# EasyEDA Pro project 基于ASM1153E的TYPEC接口的MSATA硬盘盒子.eprj, schematic schematic1_1
Create Date: 2022-09-16; Page Name: P1; Project Name: 基于ASM1153E的TYPEC接口的MSATA硬盘盒子; Schematic Name: Schematic1_1; Update Date: 2022-10-08; Company: 嘉立创EDA
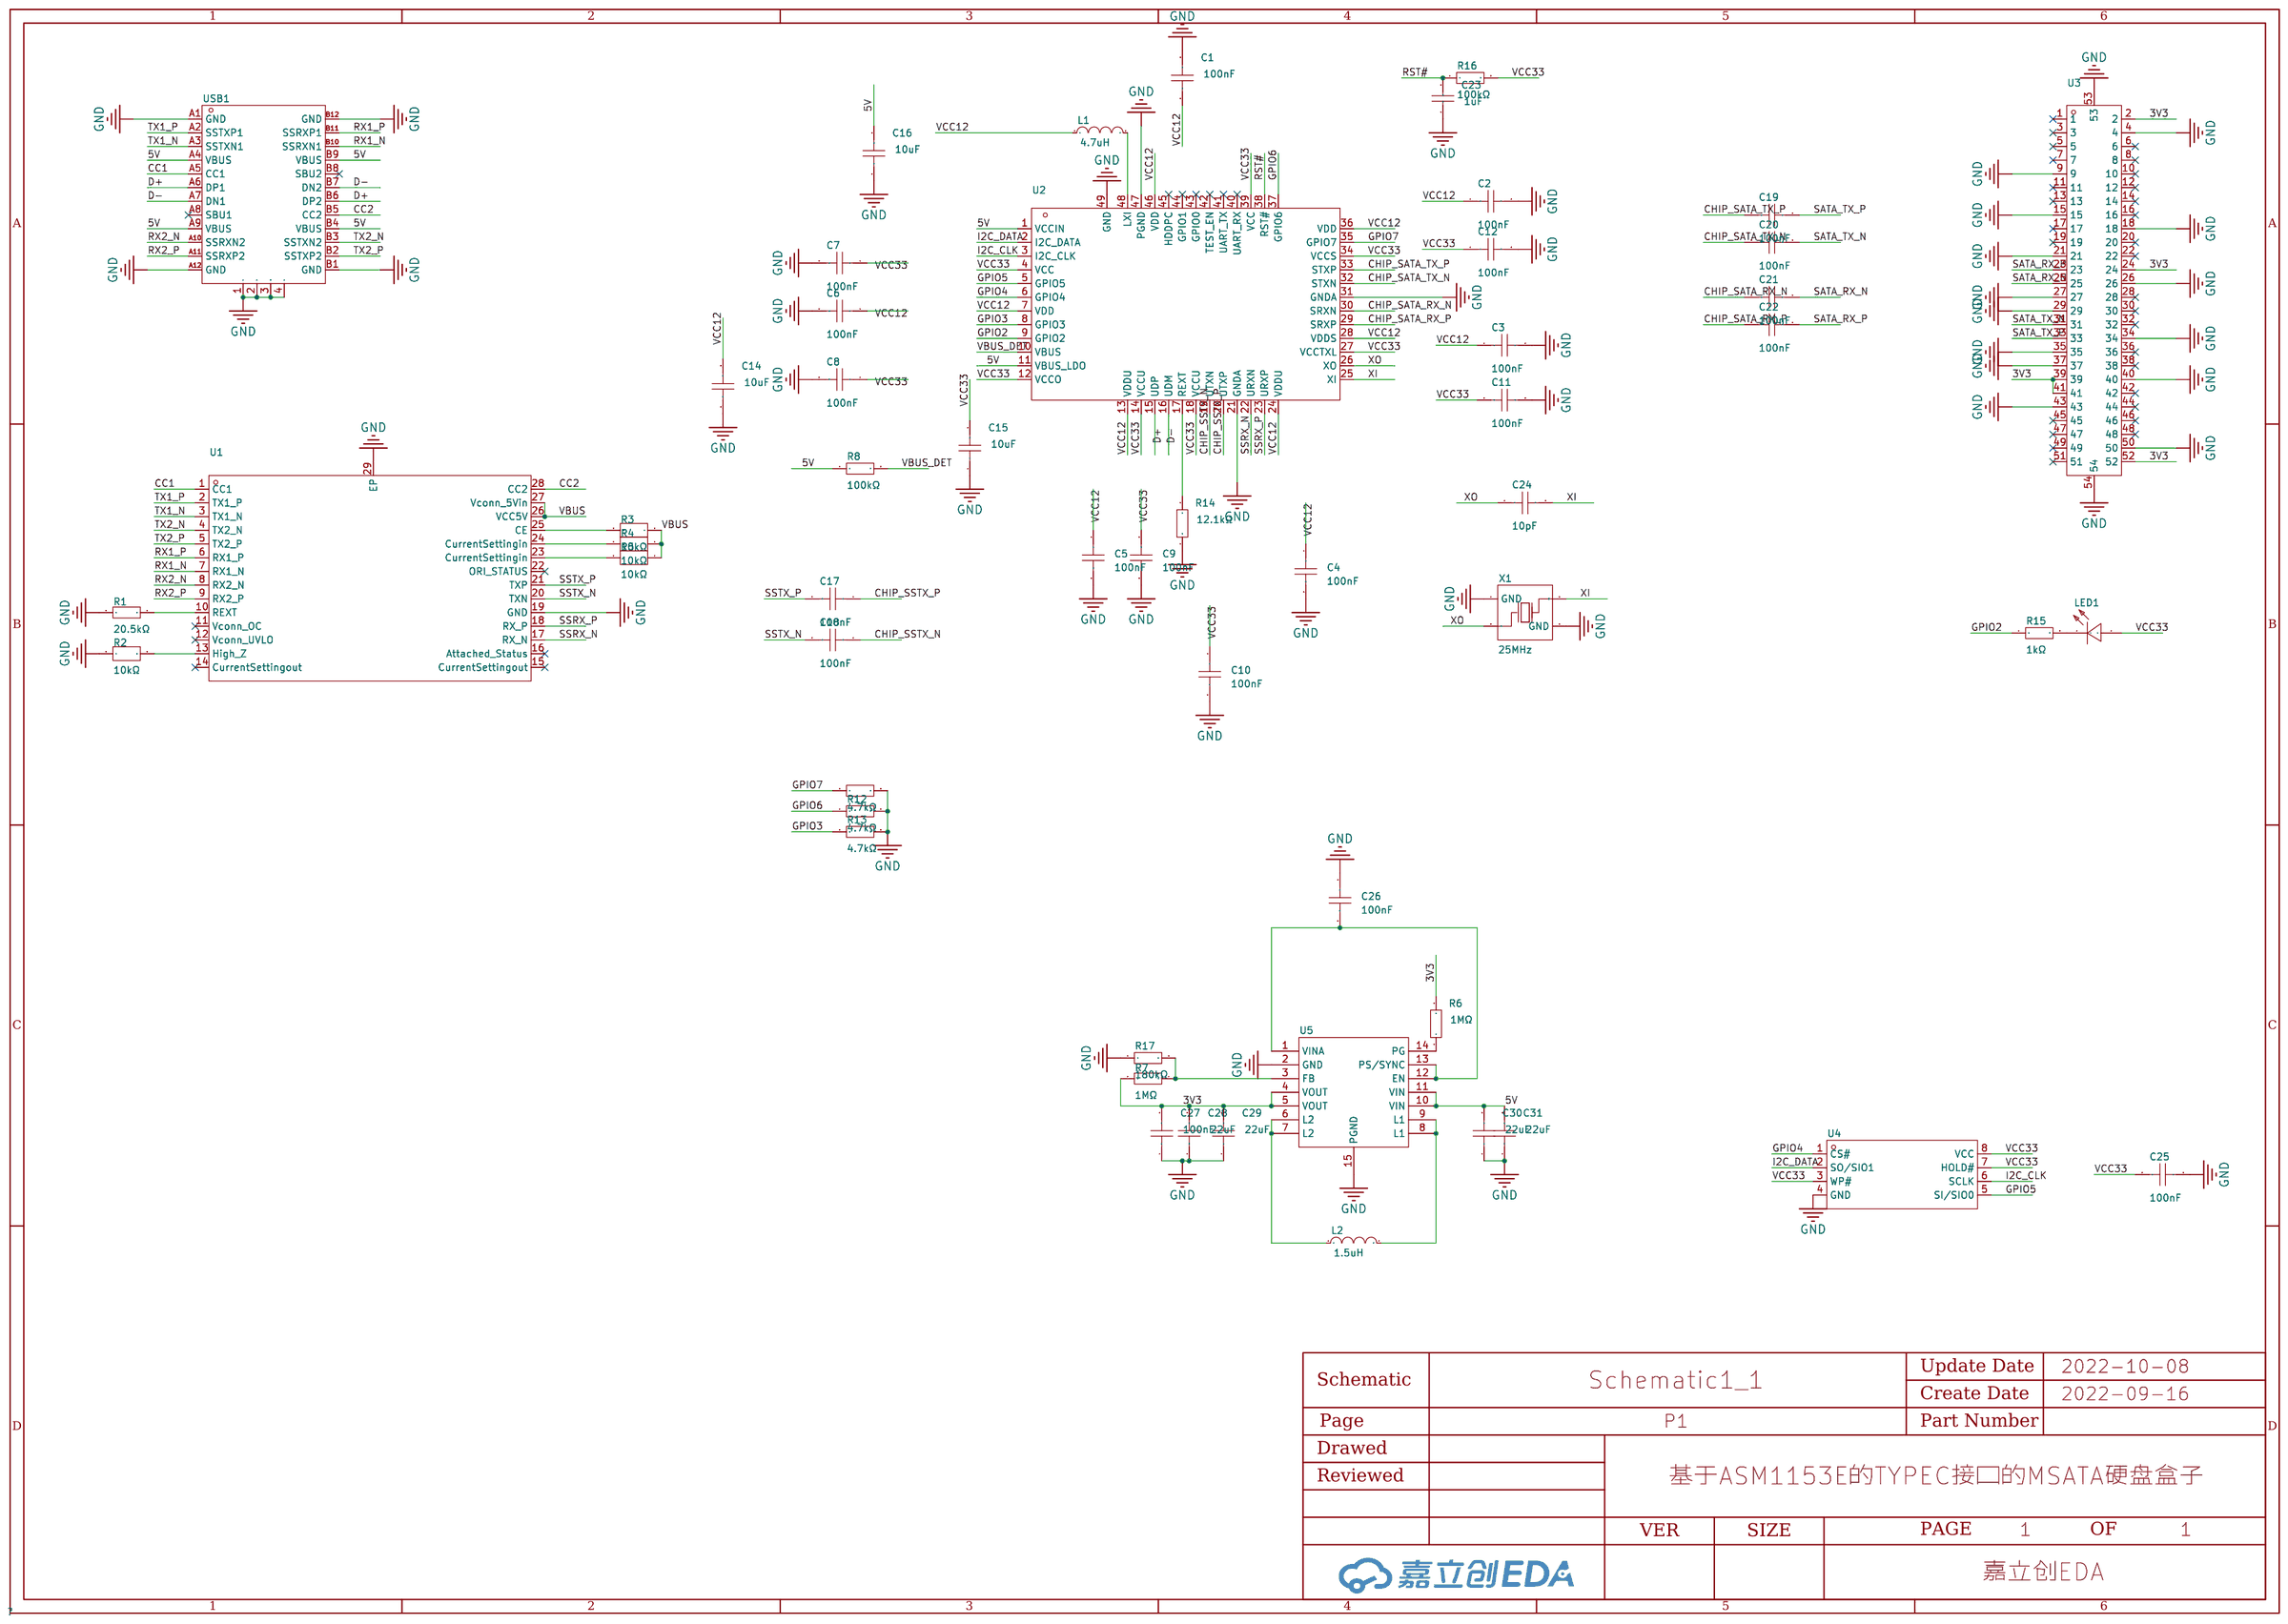
[diagram p1: schematic sheet]

## Parts
C1  100nF  [C0402]
C2  100nF  [C0402]
C3  100nF  [C0402]
C4  100nF  [C0402]
C5  100nF  [C0402]
C6  100nF  [C0402]
C7  100nF  [C0402]
C8  100nF  [C0402]
C9  100nF  [C0402]
C10  100nF  [C0402]
C11  100nF  [C0402]
C12  100nF  [C0402]
C14  10uF  [C0603]
C15  10uF  [C0603]
C16  10uF  [C0603]
C17  100nF  [C0402]
C18  100nF  [C0402]
C19  100nF  [C0402]
C20  100nF  [C0402]
C21  100nF  [C0402]
C22  100nF  [C0402]
C23  1uF  [C0402]
C24  10pF  [C0402]
C25  100nF  [C0402]
C26  100nF  [C0402]
C27  100nF  [C0402]
C28  22uF  [C0603]
C29  22uF  [C0603]
C30  22uF  [C0603]
C31  22uF  [C0603]
L1  4.7uH  [IND-SMD_L3.0-W3.0-1]
L2  1.5uH  [IND-SMD_L4.8-W4.2]
LED1  VLMW1500-GS08  [LED0402-R-RD_WHITE]
R1  20.5kΩ  [R0402]
R2  10kΩ  [R0402]
R3  10kΩ  [R0402]
R4  10kΩ  [R0402]
R5  10kΩ  [R0402]
R6  1MΩ  [R0402]
R7  1MΩ  [R0402]
R8  100kΩ  [R0402]
R11  4.7kΩ  [R0402]
R12  4.7kΩ  [R0402]
R13  4.7kΩ  [R0402]
R14  12.1kΩ  [R0402]
R15  1kΩ  [R0402]
R16  100kΩ  [R0402]
R17  180kΩ  [R0402]
U1  VL160  [MQFN-28_L4.5-W3.5-P0.40-BL-EP]
U2  ASM1153E  [QFN-48_L6.0-W6.0-P0.40-BL-EP4.2]
U3  PCIE-52P70H  [PCIE-SMD_52P-P0.80_PCIE-52PXXH]
U4  MX25L512EMI-10G  [SOP-8_L5.0-W4.0-P1.27-LS6.0-BL]
U5  TPS63020DSJR  [VSON-14_L4.0-W3.0-P0.50-BL-EP_TI_DSJ]
USB1  U262-241N-4BV60  [USB-C-SMD_U262-241N-4BV60]
X1  25MHz  [CRYSTAL-SMD_4P-L3.2-W2.5-BL]

## Library data of the parts
C1-C12 C17-C22 C25-C27 = TCC0402X5R104M250AT: 容值:100nF;精度:±20%;额定电压:25V;材质(温度系数):X5R;; LCSC Part Name: 100nF ±20% 25V; Supplier Part: C359190; Manufacturer: CCTC(三环); Supplier Footprint: 0402; JLCPCB Part Class: Extended Part; Datasheet: https://atta.szlcsc.com/upload/public/pdf/source/20190103/C359190_40860758378AF13613616C0AB9EED028.pdf; Supplier: LCSC; Tolerance: ±20%; Voltage Rated: 25V; Temperature Coefficient: X5R
C14-C16 = CL10A106KP8NNNC: 容值:10uF;精度:±10%;额定电压:10V;材质(温度系数):X5R;; LCSC Part Name: 10uF ±10% 10V; Supplier Part: C19702; Manufacturer: SAMSUNG(三星); Supplier Footprint: 0603; JLCPCB Part Class: Basic Part; Datasheet: https://atta.szlcsc.com/upload/public/pdf/source/20160103/1457707703378.pdf; Supplier: LCSC; Tolerance: ±10%; Voltage Rated: 10V; Temperature Coefficient: X5R
C23 = CL05A105KP5NNNC: 容值:1uF;精度:±10%;额定电压:10V;材质(温度系数):X5R;; LCSC Part Name: 1uF ±10% 10V; Supplier Part: C14445; Manufacturer: SAMSUNG(三星); Supplier Footprint: 0402; JLCPCB Part Class: Extended Part; Datasheet: https://atta.szlcsc.com/upload/public/pdf/source/20160103/1457707670698.pdf; Supplier: LCSC; Tolerance: ±10%; Voltage Rated: 10V; Temperature Coefficient: X5R
C24 = TCC0402COG100J500AT: 容值:10pF;精度:±5%;额定电压:50V;材质(温度系数):C0G;; LCSC Part Name: 10pF ±5% 50V; Supplier Part: C696913; Manufacturer: CCTC(三环); Supplier Footprint: 0402; JLCPCB Part Class: Extended Part; Datasheet: https://atta.szlcsc.com/upload/public/pdf/source/20200707/C696841_89A2C111301AB76AE7642008585E7A11.pdf; Supplier: LCSC; Tolerance: ±5%; Voltage Rated: 50V; Temperature Coefficient: C0G
C28-C31 = CL10A226MQ8NRNC: 容值:22uF;精度:±20%;额定电压:6.3V;材质(温度系数):X5R;; LCSC Part Name: 22uF ±20% 6.3V; Supplier Part: C59461; Manufacturer: SAMSUNG(三星); Supplier Footprint: 0603; JLCPCB Part Class: Basic Part; Datasheet: https://atta.szlcsc.com/upload/public/pdf/source/20160103/1457707740762.pdf; Supplier: LCSC; Tolerance: ±20%; Voltage Rated: 6.3V; Temperature Coefficient: X5R
L1 = CKCS3012-4.7uH/M: 电感值:4.7uH;精度:±20%;额定电流:1.24A;直流电阻(DCR):120mΩ;; LCSC Part Name: 4.7uH ±20% 1.24A 120mΩ; Supplier Part: C354557; Manufacturer: CENKER(岑科); Supplier Footprint: SMD; JLCPCB Part Class: Extended Part; Datasheet: https://atta.szlcsc.com/upload/public/pdf/source/20190115/C354557_61A3705615E4FADB9C94D2137EE09B6B.pdf; Supplier: LCSC; Tolerance: ±20%; Rated Current: 1.24A; DC Resistance (DCR): 120mΩ
L2 = MS0420-1R5M: 电感值:1.5uH;精度:±20%;额定电流:4A;直流电阻(DCR):35mΩ;; LCSC Part Name: 1.5uH ±20% 4A 35mΩ; Supplier Part: C380153; Manufacturer: COILMX(迈翔科技); Supplier Footprint: SMD; JLCPCB Part Class: Extended Part; Datasheet: https://atta.szlcsc.com/upload/public/pdf/source/20191021/C380153_440E456AF310E1A9315D20E9E84C4BE2.pdf; Supplier: LCSC; Tolerance: ±20%; Rated Current: 4A; DC Resistance (DCR): 35mΩ
LED1 = VLMW1500-GS08: 发光颜色:白灯;二极管配置:-;透镜颜色:-;主波长:-;峰值波长:-;色温:-;光通量(25时):-;测试电流:5mA;正向电压(VF):2.9V;发光强度:90mcd;功率:70mW;发光角度:-;安装方式:-;工作温度:-30~+80;; LCSC Part Name: 白灯; Supplier Part: C511379; Manufacturer: VISHAY(威世); Supplier Footprint: 0402; JLCPCB Part Class: Extended Part; Datasheet: https://atta.szlcsc.com/upload/public/pdf/source/20200408/C511379_C2F59698F604A60E2C48FD851172BBA0.pdf; Supplier: LCSC; Emitted Color: 白灯; Forward Current: 5mA; Forward Voltage (VF): 2.9V; Luminous Intensity: 90mcd; Power Dissipation: 70mW; Operating Temperature: -30~+80
R1 = RC-02W2052FT: 阻值:20.5kΩ;精度:±1%;功率:62.5mW;温度系数:±200ppm/;最大工作电压:50V;工作温度范围:-55~+155;; LCSC Part Name: 20.5kΩ ±1% 62.5mW; Supplier Part: C321365; Manufacturer: FH(风华); Supplier Footprint: 0402; JLCPCB Part Class: Extended Part; Datasheet: https://atta.szlcsc.com/upload/public/pdf/source/20181116/C321365_E54ACAD8F32292381B4F832BB45E049B.pdf; Supplier: LCSC; Tolerance: ±1%; Power(Watts): 62.5mW; Temperature Coefficient: ±200ppm/; Overload Voltage (Max): 50V; Operating Temperature Range: -55~+155
R2-R5 = FRC0402J103 TS: 电阻类型:厚膜电阻;阻值:10kΩ;精度:±5%;功率:62.5mW;温度系数:±100ppm/;最大工作电压:50V;工作温度范围:-55~+155;; LCSC Part Name: 10kΩ ±5% 62.5mW; Supplier Part: C2906885; Manufacturer: FOJAN(富捷); Supplier Footprint: 0402; JLCPCB Part Class: Extended Part; Datasheet: https://atta.szlcsc.com/upload/public/pdf/source/20211102/08480A48F159CF742D398A1E4DC90941.pdf; Supplier: LCSC; Type: 厚膜电阻; Tolerance: ±5%; Power(Watts): 62.5mW; Temperature Coefficient: ±100ppm/; Overload Voltage (Max): 50V; Operating Temperature Range: -55~+155
R6 R7 = RTT02105JTH: 电阻类型:厚膜电阻;阻值:1MΩ;精度:±5%;功率:1/16W;温度系数:±100ppm/;最大工作电压:50V;工作温度范围:-55~+155;; LCSC Part Name: 1MΩ ±5%; Supplier Part: C102763; Manufacturer: RALEC(旺诠); Supplier Footprint: 0402; JLCPCB Part Class: Extended Part; Datasheet: https://atta.szlcsc.com/upload/public/pdf/source/20170408/1491642598637.pdf; Supplier: LCSC; Type: 厚膜电阻; Tolerance: ±5%; Power(Watts): 1/16W; Temperature Coefficient: ±100ppm/; Overload Voltage (Max): 50V; Operating Temperature Range: -55~+155
R8 R16 = CR0402JF0104G: 电阻类型:厚膜电阻;阻值:100kΩ;精度:±5%;功率:62.5mW;温度系数:±200ppm/;最大工作电压:50V;工作温度范围:-55~+125;; LCSC Part Name: 100kΩ ±5% 62.5mW; Supplier Part: C100573; Manufacturer: LIZ(丽智电子); Supplier Footprint: 0402; JLCPCB Part Class: Extended Part; Datasheet: https://atta.szlcsc.com/upload/public/pdf/source/20170408/1491631220702.pdf; Supplier: LCSC; Type: 厚膜电阻; Tolerance: ±5%; Power(Watts): 62.5mW; Temperature Coefficient: ±200ppm/; Overload Voltage (Max): 50V; Operating Temperature Range: -55~+125
R11-R13 = 0402WGJ0472TCE: 电阻类型:厚膜电阻;阻值:4.7kΩ;精度:±5%;功率:1/16W;温度系数:±100ppm/;最大工作电压:50V;工作温度范围:-55~+155;; LCSC Part Name: 4.7kΩ ±5%; Supplier Part: C25940; Manufacturer: UNI-ROYAL(厚声); Supplier Footprint: 0402; JLCPCB Part Class: Extended Part; Datasheet: https://atta.szlcsc.com/upload/public/pdf/source/20200306/C422600_1E6D84923E4A46A82E41ADD87F860B5C.pdf; Supplier: LCSC; Type: 厚膜电阻; Tolerance: ±5%; Power(Watts): 1/16W; Temperature Coefficient: ±100ppm/; Overload Voltage (Max): 50V; Operating Temperature Range: -55~+155
R14 = RC-02W1212FT: 阻值:12.1kΩ;精度:±1%;功率:62.5mW;温度系数:±200ppm/;最大工作电压:50V;工作温度范围:-55~+155;; LCSC Part Name: 12.1kΩ ±1% 62.5mW; Supplier Part: C321280; Manufacturer: FH(风华); Supplier Footprint: 0402; JLCPCB Part Class: Extended Part; Datasheet: https://atta.szlcsc.com/upload/public/pdf/source/20181129/C321280_9F126374E01D2C505D3C2BDB1D16BD85.pdf; Supplier: LCSC; Tolerance: ±1%; Power(Watts): 62.5mW; Temperature Coefficient: ±200ppm/; Overload Voltage (Max): 50V; Operating Temperature Range: -55~+155
R15 = RC-02K102JT: 阻值:1kΩ;精度:±5%;功率:62.5mW;温度系数:±100ppm/;最大工作电压:50V;工作温度范围:-55~+155;; LCSC Part Name: 1kΩ ±5% 62.5mW; Supplier Part: C140196; Manufacturer: FH(风华); Supplier Footprint: 0402; JLCPCB Part Class: Extended Part; Datasheet: https://atta.szlcsc.com/upload/public/pdf/source/20171106/C140196_15099446043381092285.pdf; Supplier: LCSC; Tolerance: ±5%; Power(Watts): 62.5mW; Temperature Coefficient: ±100ppm/; Overload Voltage (Max): 50V; Operating Temperature Range: -55~+155
R17 = RC-02W1803FT: 功率:1/16W;精度:±1%;温度系数:±200ppm/;阻值:180kΩ;最大工作电压:50V;工作温度范围:-55~+155;; LCSC Part Name: 180KΩ(1803) ±1%; Supplier Part: C140199; Manufacturer: FH(风华); Supplier Footprint: 0402; JLCPCB Part Class: Extended Part; Datasheet: https://atta.szlcsc.com/upload/public/pdf/source/20171106/C140199_15099446075091092288.pdf; Supplier: LCSC; Power(Watts): 1/16W; Tolerance: ±1%; Temperature Coefficient: ±200ppm/; Overload Voltage (Max): 50V; Operating Temperature Range: -55~+155
U1 = VL160: 类型:-;协议类别:-;驱动器/接收器数:-;数据速率:-;; Supplier Part: C2841472; Supplier Footprint: MQFN-28; JLCPCB Part Class: Extended Part; Datasheet: https://atta.szlcsc.com/upload/public/pdf/source/20210707/C2841472_23203D4DC0B460F77735B81667EEBB6C.pdf; Supplier: LCSC
U2 = ASM1153E: Supplier Part: C2762919; Supplier Footprint: LQFN-48_EP_6.0x6.0x0.4P; JLCPCB Part Class: Extended Part; Datasheet: 2021-03-22/601605W/2276bd4a79cf4165b237c0c17b58d9ef/ASM1153Datasheetv1_1.pdf; Supplier: LCSC
U3 = PCIE-52P70H: mPCI-E 0.8mm P数:52 H7.0; Supplier Part: C2982554; Manufacturer: XUNPU(讯普); Supplier Footprint: SMD; JLCPCB Part Class: Extended Part; Datasheet: https://atta.szlcsc.com/upload/public/pdf/source/20220311/DC8B167F9A8E29C645B8AA97E9059897.pdf; Supplier: LCSC
U4 = MX25L512EMI-10G: Supplier Part: C2803023; Manufacturer: MXIC(旺宏电子); Supplier Footprint: SOP-8; JLCPCB Part Class: Extended Part; Datasheet: https://atta.szlcsc.com/upload/public/pdf/source/20210906/B454D1B9C39ED3C00F3164A690CF7DD8.pdf; Supplier: LCSC
U5 = TPS63020DSJR: 功能类型:升降压型;同步整流:是;输出通道数:1;拓扑结构:降压-升压式;输入电压:1.8V~5.5V;输出电压:1.2V~5.5V;输出电流(最大值):3.5A;开关频率:2.4MHz;; LCSC Part Name: 升降压型 1.8V~5.5V 3.5A 2.4MHz; Supplier Part: C15483; Manufacturer: TI(德州仪器); Supplier Footprint: VSON-14_3x4x05P; JLCPCB Part Class: Extended Part; Datasheet: https://atta.szlcsc.com/upload/public/pdf/source/20140704/1457707124625.pdf; Supplier: LCSC; Function: 升降压型; Synchronous Rectification: 是; Number of Outputs: 1; Topology: 降压-升压式; Input Voltage: 1.8V~5.5V; Output Voltage: 1.2V~5.5V; Output Current (Max): 3.5A; Switching Frequency: 2.4MHz
USB1 = U262-241N-4BV60: 连接器类型:Type-C;标准:USB 3.1;公母:母座;触点数量:24;端口数量:1;安装方式:弯插;额定电流 - 电源:3A;触头材质:铜合金;触头镀层:金;工作温度范围:-25~+80;焊接温度(最大值):260;; LCSC Part Name: Type-C 母座 弯插; Supplier Part: C388659; Manufacturer: XKB Connectivity(中国星坤); Supplier Footprint: SMD; JLCPCB Part Class: Extended Part; Datasheet: https://atta.szlcsc.com/upload/public/pdf/source/20211011/6F31BA4921B93E6D583294FE39BD87C3.pdf; Supplier: LCSC; Connector Type: Type-C; Standard: USB 3.1; Gender: 母座; Number of Contacts: 24; Number of Ports: 1; Mounting Style: 弯插; Current Rating - Power (Max): 3A; Contact Material: 铜合金; Contact Plating: 金; Operating Temperature Range: -25~+80; Welding Temperature (Max): 260
X1 = X1E0000210621: 晶振类型:贴片无源晶振;频率:25MHz;频率公差:±10ppm;频率稳定度:-;负载电容:9pF;等效串联电阻(ESR):40Ω;工作温度:-40~+85;; LCSC Part Name: 25MHz ±10ppm 9pF; Supplier Part: C255920; Manufacturer: EPSON(爱普生); Supplier Footprint: SMD3225-4P; JLCPCB Part Class: Extended Part; Datasheet: https://atta.szlcsc.com/upload/public/pdf/source/20180822/C255920_F9528E19433D1B377CB88CCBF483E490.pdf; Supplier: LCSC; Crystal Type: 贴片无源晶振; Frequency Tolerance: ±10ppm; Load Capacitance: 9pF; Equivalent Series Resistance (ESR): 40Ω; Operating Temperature: -40~+85

## Nets
3V3: C27.2 C28.2 C29.2 R6.2 R7.2 U3.2 U3.24 U3.39 U3.41 U3.52 U5.4(VOUT) U5.5(VOUT)
5V: C16.2 C30.2 C31.2 R8.1 U2.1(VCCIN) U2.11(VBUS_LDO) U5.10(VIN) U5.11(VIN) USB1.A4(VBUS) USB1.A9(VBUS) USB1.B4(VBUS) USB1.B9(VBUS)
GND: C1.2 C2.2 C3.2 C4.2 C5.2 C6.2 C7.2 C8.2 C9.2 C10.2 C11.2 C12.2 C14.1 C15.1 C16.1 C23.1 C25.2 C26.1 C27.1 C28.1 C29.1 C30.1 C31.1 R1.1 R2.1 R11.2 R12.2 R13.2 R14.1 R17.1 U1.19(GND) U1.29(EP) U2.21(GNDA) U2.31(GNDA) U2.47(PGND) U2.49(GND) U3.4 U3.9 U3.15 U3.18 U3.21 U3.26 U3.27 U3.29 U3.34 U3.35 U3.37 U3.40 U3.43 U3.50 U3.53 U3.54 U4.4(GND) U5.2(GND) U5.15(PGND) USB1.1 USB1.2 USB1.3 USB1.4 USB1.A1(GND) USB1.A12(GND) USB1.B1(GND) USB1.B12(GND) X1.2(GND) X1.4(GND)
VBUS: R3.1 R4.1 R5.1 U1.26(VCC5V) U1.27(Vconn_5Vin)
VBUS_DET: R8.2 U2.10(VBUS)
VCC12: C1.1 C2.1 C3.1 C4.1 C5.1 C6.1 C14.2 L1.1 U2.7(VDD) U2.13(VDDU) U2.24(VDDU) U2.28(VDDS) U2.36(VDD) U2.46(VDD)
VCC33: C7.1 C8.1 C9.1 C10.1 C11.1 C12.1 C15.2 C25.1 LED1.1(A) R16.2 U2.4(VCC) U2.12(VCCO) U2.14(VCCU) U2.18(VCCU) U2.27(VCCTXL) U2.34(VCCS) U2.39(VCC) U4.3(WP#) U4.7(HOLD#) U4.8(VCC)
CC1: U1.1(CC1) USB1.A5(CC1)
CC2: U1.28(CC2) USB1.B5(CC2)
CHIP_SATA_RX_N: C21.1 U2.30(SRXN)
CHIP_SATA_RX_P: C22.1 U2.29(SRXP)
CHIP_SATA_TX_N: C20.1 U2.32(STXN)
CHIP_SATA_TX_P: C19.1 U2.33(STXP)
CHIP_SSTX_N: C18.1 U2.19(UTXN)
CHIP_SSTX_P: C17.1 U2.20(UTXP)
D+: U2.15(UDP) USB1.A6(DP1) USB1.B6(DP2)
D-: U2.16(UDM) USB1.A7(DN1) USB1.B7(DN2)
GPIO2: R15.1 U2.9(GPIO2)
GPIO3: R13.1 U2.8(GPIO3)
GPIO4: U2.6(GPIO4) U4.1(CS#)
GPIO5: U2.5(GPIO5) U4.5(SI/SIO0)
GPIO6: R12.1 U2.37(GPIO6)
GPIO7: R11.1 U2.35(GPIO7)
I2C_CLK: U2.3(I2C_CLK) U4.6(SCLK)
I2C_DATA: U2.2(I2C_DATA) U4.2(SO/SIO1)
RST#: C23.2 R16.1 U2.38(RST#)
RX1_N: U1.7(RX1_N) USB1.B10(SSRXN1)
RX1_P: U1.6(RX1_P) USB1.B11(SSRXP1)
RX2_N: U1.8(RX2_N) USB1.A10(SSRXN2)
RX2_P: U1.9(RX2_P) USB1.A11(SSRXP2)
SATA_RX_N: C21.2 U3.25
SATA_RX_P: C22.2 U3.23
SATA_TX_N: C20.2 U3.31
SATA_TX_P: C19.2 U3.33
SSRX_N: U1.17(RX_N) U2.22(URXN)
SSRX_P: U1.18(RX_P) U2.23(URXP)
SSTX_N: C18.2 U1.20(TXN)
SSTX_P: C17.2 U1.21(TXP)
TX1_N: U1.3(TX1_N) USB1.A3(SSTXN1)
TX1_P: U1.2(TX1_P) USB1.A2(SSTXP1)
TX2_N: U1.4(TX2_N) USB1.B3(SSTXN2)
TX2_P: U1.5(TX2_P) USB1.B2(SSTXP2)
XI: C24.2 U2.25(XI) X1.3(OSC2)
XO: C24.1 U2.26(XO) X1.1(OSC1)
$1N1444: R1.2 U1.10(REXT)
$1N1618: R2.2 U1.13(High_Z)
$1N2073: R4.2 U1.24(CurrentSettingin)
$1N2189: R5.2 U1.23(CurrentSettingin)
$1N2538: R3.2 U1.25(CE)
$1N7039: R14.2 U2.17(REXT)
$1N7428: L1.2 U2.48(LXI)
$1N7831: LED1.2(K) R15.2
$1N14209: L2.1 U5.6(L2) U5.7(L2)
$1N14210: L2.2 U5.8(L1) U5.9(L1)
$1N14211: R7.1 R17.2 U5.3(FB)
$1N14216: C26.2 U5.1(VINA) U5.12(EN) U5.13(PS/SYNC)
$1N14218: R6.1 U5.14(PG)

Not connected (* = marked no-connect by the designer): U1 11(Vconn_OC)* 12(Vconn_UVLO)* 14(CurrentSettingout)* 15(CurrentSettingout)* 16(Attached_Status)* 22(ORI_STATUS)*; U2 40(UART_RX)* 41(UART_TX)* 42(TEST_EN)* 43(GPIO0)* 44(GPIO1)* 45(HDDPC)*; U3 1* 3* 5* 6* 7* 8* 10* 11* 12* 13* 14* 16* 17* 19* 20* 22* 28* 30* 32* 36* 38* 42* 44* 45* 46* 47* 48* 49* 51*; USB1 A8(SBU1)* B8(SBU2)*
